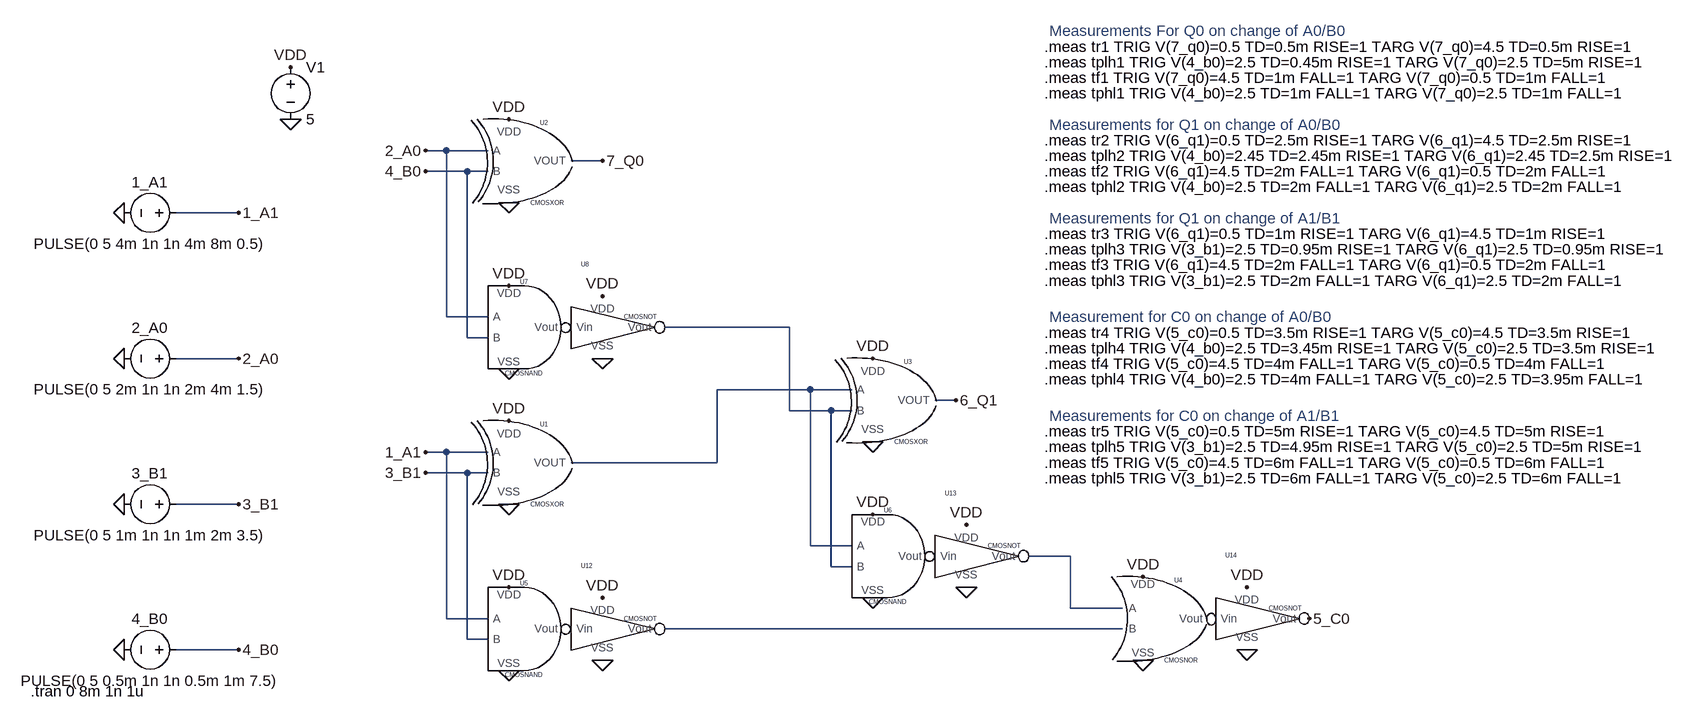
[diagram p0: schematic Circuit.asc]
Circuit.asc, the LTspice schematic file:
Version 4
SHEET 1 2108 2096
WIRE 208 16 176 16
WIRE 272 16 208 16
WIRE 448 32 400 32
WIRE 240 48 176 48
WIRE 272 48 240 48
WIRE -112 112 -208 112
WIRE 208 272 208 16
WIRE 272 272 208 272
WIRE 736 288 544 288
WIRE 240 304 240 48
WIRE 272 304 240 304
WIRE -112 336 -208 336
WIRE 768 384 624 384
WIRE 832 384 768 384
WIRE 992 400 960 400
WIRE 736 416 736 288
WIRE 800 416 736 416
WIRE 832 416 800 416
WIRE 208 480 176 480
WIRE 272 480 208 480
WIRE 624 496 624 384
WIRE 624 496 400 496
WIRE 240 512 176 512
WIRE 272 512 240 512
WIRE -112 560 -208 560
WIRE 768 624 768 384
WIRE 832 624 768 624
WIRE 1168 640 1104 640
WIRE 800 656 800 416
WIRE 832 656 800 656
WIRE 1168 720 1168 640
WIRE 1248 720 1168 720
WIRE 208 736 208 480
WIRE 272 736 208 736
WIRE 1248 752 544 752
WIRE 240 768 240 512
WIRE 272 768 240 768
WIRE -112 784 -208 784
FLAG -112 112 1_A1
FLAG -288 112 0
FLAG -112 336 2_A0
FLAG -288 336 0
FLAG -112 560 3_B1
FLAG -288 560 0
FLAG -112 784 4_B0
FLAG -288 784 0
FLAG 176 16 2_A0
FLAG 176 48 4_B0
FLAG 448 32 7_Q0
FLAG 176 480 1_A1
FLAG 176 512 3_B1
FLAG 992 400 6_Q1
FLAG 1536 736 5_C0
FLAG 448 240 VDD
FLAG 304 -32 VDD
FLAG 304 224 VDD
FLAG 304 432 VDD
FLAG 304 688 VDD
FLAG 448 704 VDD
FLAG 864 336 VDD
FLAG 864 576 VDD
FLAG 1008 592 VDD
FLAG 1280 672 VDD
FLAG 1440 688 VDD
FLAG 304 96 0
FLAG 448 336 0
FLAG 304 352 0
FLAG 304 560 0
FLAG 448 800 0
FLAG 304 816 0
FLAG 864 704 0
FLAG 864 464 0
FLAG 1008 688 0
FLAG 1280 800 0
FLAG 1440 784 0
FLAG -32 -32 0
FLAG -32 -112 VDD
SYMBOL voltage -192 112 R90
WINDOW 0 -32 56 VBottom 2
WINDOW 3 32 56 VTop 2
WINDOW 123 0 0 Left 0
WINDOW 39 0 0 Left 0
SYMATTR InstName 1_A1
SYMATTR Value PULSE(0 5 4m 1n 1n 4m 8m 0.5)
SYMBOL voltage -192 336 R90
WINDOW 0 -32 56 VBottom 2
WINDOW 3 32 56 VTop 2
WINDOW 123 0 0 Left 0
WINDOW 39 0 0 Left 0
SYMATTR InstName 2_A0
SYMATTR Value PULSE(0 5 2m 1n 1n 2m 4m 1.5)
SYMBOL voltage -192 560 R90
WINDOW 0 -32 56 VBottom 2
WINDOW 3 32 56 VTop 2
WINDOW 123 0 0 Left 0
WINDOW 39 0 0 Left 0
SYMATTR InstName 3_B1
SYMATTR Value PULSE(0 5 1m 1n 1n 1m 2m 3.5)
SYMBOL voltage -192 784 R90
WINDOW 0 -32 56 VBottom 2
WINDOW 3 32 56 VTop 2
WINDOW 123 0 0 Left 0
WINDOW 39 0 0 Left 0
SYMATTR InstName 4_B0
SYMATTR Value PULSE(0 5 0.5m 1n 1n 0.5m 1m 7.5)
SYMBOL CMOSNOR 1312 736 R0
SYMATTR InstName U4
SYMBOL CMOSNAND 320 752 R0
SYMATTR InstName U5
SYMBOL CMOSNAND 880 640 R0
SYMATTR InstName U6
SYMBOL CMOSNAND 320 288 R0
SYMATTR InstName U7
SYMBOL NOT 400 288 R0
SYMATTR InstName U8
SYMBOL NOT 400 752 R0
SYMATTR InstName U12
SYMBOL NOT 960 640 R0
SYMATTR InstName U13
SYMBOL NOT 1392 736 R0
SYMATTR InstName U14
SYMBOL voltage -32 -128 R0
WINDOW 123 0 0 Left 0
WINDOW 39 0 0 Left 0
SYMATTR InstName V1
SYMATTR Value 5
SYMBOL XOR 336 496 R0
SYMATTR InstName U1
SYMBOL XOR 336 32 R0
SYMATTR InstName U2
SYMBOL XOR 896 400 R0
SYMATTR InstName U3
TEXT -432 848 Left 2 !.tran 0 8m 1n 1u
TEXT 1136 -168 Left 2 ;Measurements For Q0 on change of A0/B0
TEXT 1128 -144 Left 2 !.meas tr1 TRIG V(7_q0)=0.5 TD=0.5m RISE=1 TARG V(7_q0)=4.5 TD=0.5m RISE=1
TEXT 1128 -120 Left 2 !.meas tplh1 TRIG V(4_b0)=2.5 TD=0.45m RISE=1 TARG V(7_q0)=2.5 TD=5m RISE=1
TEXT 1128 -96 Left 2 !.meas tf1 TRIG V(7_q0)=4.5 TD=1m FALL=1 TARG V(7_q0)=0.5 TD=1m FALL=1
TEXT 1128 -72 Left 2 !.meas tphl1 TRIG V(4_b0)=2.5 TD=1m FALL=1 TARG V(7_q0)=2.5 TD=1m FALL=1
TEXT 1136 -24 Left 2 ;Measurements for Q1 on change of A0/B0
TEXT 1128 0 Left 2 !.meas tr2 TRIG V(6_q1)=0.5 TD=2.5m RISE=1 TARG V(6_q1)=4.5 TD=2.5m RISE=1
TEXT 1128 24 Left 2 !.meas tplh2 TRIG V(4_b0)=2.45 TD=2.45m RISE=1 TARG V(6_q1)=2.45 TD=2.5m RISE=1
TEXT 1128 48 Left 2 !.meas tf2 TRIG V(6_q1)=4.5 TD=2m FALL=1 TARG V(6_q1)=0.5 TD=2m FALL=1
TEXT 1128 72 Left 2 !.meas tphl2 TRIG V(4_b0)=2.5 TD=2m FALL=1 TARG V(6_q1)=2.5 TD=2m FALL=1
TEXT 1136 120 Left 2 ;Measurements for Q1 on change of A1/B1
TEXT 1128 144 Left 2 !.meas tr3 TRIG V(6_q1)=0.5 TD=1m RISE=1 TARG V(6_q1)=4.5 TD=1m RISE=1
TEXT 1128 168 Left 2 !.meas tplh3 TRIG V(3_b1)=2.5 TD=0.95m RISE=1 TARG V(6_q1)=2.5 TD=0.95m RISE=1
TEXT 1128 192 Left 2 !.meas tf3 TRIG V(6_q1)=4.5 TD=2m FALL=1 TARG V(6_q1)=0.5 TD=2m FALL=1
TEXT 1128 216 Left 2 !.meas tphl3 TRIG V(3_b1)=2.5 TD=2m FALL=1 TARG V(6_q1)=2.5 TD=2m FALL=1
TEXT 1136 272 Left 2 ;Measurement for C0 on change of A0/B0
TEXT 1128 296 Left 2 !.meas tr4 TRIG V(5_c0)=0.5 TD=3.5m RISE=1 TARG V(5_c0)=4.5 TD=3.5m RISE=1
TEXT 1128 320 Left 2 !.meas tplh4 TRIG V(4_b0)=2.5 TD=3.45m RISE=1 TARG V(5_c0)=2.5 TD=3.5m RISE=1
TEXT 1128 344 Left 2 !.meas tf4 TRIG V(5_c0)=4.5 TD=4m FALL=1 TARG V(5_c0)=0.5 TD=4m FALL=1
TEXT 1128 368 Left 2 !.meas tphl4 TRIG V(4_b0)=2.5 TD=4m FALL=1 TARG V(5_c0)=2.5 TD=3.95m FALL=1
TEXT 1136 424 Left 2 ;Measurements for C0 on change of A1/B1
TEXT 1128 448 Left 2 !.meas tr5 TRIG V(5_c0)=0.5 TD=5m RISE=1 TARG V(5_c0)=4.5 TD=5m RISE=1
TEXT 1128 472 Left 2 !.meas tplh5 TRIG V(3_b1)=2.5 TD=4.95m RISE=1 TARG V(5_c0)=2.5 TD=5m RISE=1
TEXT 1128 496 Left 2 !.meas tf5 TRIG V(5_c0)=4.5 TD=6m FALL=1 TARG V(5_c0)=0.5 TD=6m FALL=1
TEXT 1128 520 Left 2 !.meas tphl5 TRIG V(3_b1)=2.5 TD=6m FALL=1 TARG V(5_c0)=2.5 TD=6m FALL=1

The netlist it stands for:
* Circuit.asc
V§1_A1 1_A1 0 PULSE(0 5 4m 1n 1n 4m 8m 0.5)
V§2_A0 2_A0 0 PULSE(0 5 2m 1n 1n 2m 4m 1.5)
V§3_B1 3_B1 0 PULSE(0 5 1m 1n 1n 1m 2m 3.5)
V§4_B0 4_B0 0 PULSE(0 5 0.5m 1n 1n 0.5m 1m 7.5)
XU4 P001 N003 N004 VDD 0 CMOSNOR  ; pins Vout A B VDD VSS
XU5 P002 1_A1 3_B1 VDD 0 CMOSNAND  ; pins Vout A B VDD VSS
XU6 P003 N002 N001 VDD 0 CMOSNAND  ; pins Vout A B VDD VSS
XU7 P004 2_A0 4_B0 VDD 0 CMOSNAND  ; pins Vout A B VDD VSS
XU8 N001 P004 VDD 0 CMOSNOT  ; pins Vout Vin VDD VSS
XU12 N004 P002 VDD 0 CMOSNOT  ; pins Vout Vin VDD VSS
XU13 N003 P003 VDD 0 CMOSNOT  ; pins Vout Vin VDD VSS
XU14 5_C0 P001 VDD 0 CMOSNOT  ; pins Vout Vin VDD VSS
V1 VDD 0 5
XU1 N002 1_A1 3_B1 VDD 0 CMOSXOR  ; pins VOUT A B VDD VSS
XU2 7_Q0 2_A0 4_B0 VDD 0 CMOSXOR  ; pins VOUT A B VDD VSS
XU3 6_Q1 N002 N001 VDD 0 CMOSXOR  ; pins VOUT A B VDD VSS
.tran 0 8m 1n 1u
* Measurements For Q0 on change of A0/B0
.meas tr1 TRIG V(7_q0)=0.5 TD=0.5m RISE=1 TARG V(7_q0)=4.5 TD=0.5m RISE=1
.meas tplh1 TRIG V(4_b0)=2.5 TD=0.45m RISE=1 TARG V(7_q0)=2.5 TD=5m RISE=1
.meas tf1 TRIG V(7_q0)=4.5 TD=1m FALL=1 TARG V(7_q0)=0.5 TD=1m FALL=1
.meas tphl1 TRIG V(4_b0)=2.5 TD=1m FALL=1 TARG V(7_q0)=2.5 TD=1m FALL=1
* Measurements for Q1 on change of A0/B0
.meas tr2 TRIG V(6_q1)=0.5 TD=2.5m RISE=1 TARG V(6_q1)=4.5 TD=2.5m RISE=1
.meas tplh2 TRIG V(4_b0)=2.45 TD=2.45m RISE=1 TARG V(6_q1)=2.45 TD=2.5m RISE=1
.meas tf2 TRIG V(6_q1)=4.5 TD=2m FALL=1 TARG V(6_q1)=0.5 TD=2m FALL=1
.meas tphl2 TRIG V(4_b0)=2.5 TD=2m FALL=1 TARG V(6_q1)=2.5 TD=2m FALL=1
* Measurements for Q1 on change of A1/B1
.meas tr3 TRIG V(6_q1)=0.5 TD=1m RISE=1 TARG V(6_q1)=4.5 TD=1m RISE=1
.meas tplh3 TRIG V(3_b1)=2.5 TD=0.95m RISE=1 TARG V(6_q1)=2.5 TD=0.95m RISE=1
.meas tf3 TRIG V(6_q1)=4.5 TD=2m FALL=1 TARG V(6_q1)=0.5 TD=2m FALL=1
.meas tphl3 TRIG V(3_b1)=2.5 TD=2m FALL=1 TARG V(6_q1)=2.5 TD=2m FALL=1
* Measurement for C0 on change of A0/B0
.meas tr4 TRIG V(5_c0)=0.5 TD=3.5m RISE=1 TARG V(5_c0)=4.5 TD=3.5m RISE=1
.meas tplh4 TRIG V(4_b0)=2.5 TD=3.45m RISE=1 TARG V(5_c0)=2.5 TD=3.5m RISE=1
.meas tf4 TRIG V(5_c0)=4.5 TD=4m FALL=1 TARG V(5_c0)=0.5 TD=4m FALL=1
.meas tphl4 TRIG V(4_b0)=2.5 TD=4m FALL=1 TARG V(5_c0)=2.5 TD=3.95m FALL=1
* Measurements for C0 on change of A1/B1
.meas tr5 TRIG V(5_c0)=0.5 TD=5m RISE=1 TARG V(5_c0)=4.5 TD=5m RISE=1
.meas tplh5 TRIG V(3_b1)=2.5 TD=4.95m RISE=1 TARG V(5_c0)=2.5 TD=5m RISE=1
.meas tf5 TRIG V(5_c0)=4.5 TD=6m FALL=1 TARG V(5_c0)=0.5 TD=6m FALL=1
.meas tphl5 TRIG V(3_b1)=2.5 TD=6m FALL=1 TARG V(5_c0)=2.5 TD=6m FALL=1
.lib .\CMOSNOR.lib
.lib .\CMOSNAND.lib
.lib .\CMOSNOT.lib
.lib .\XOR.lib
.backanno
.end